# Altium project PCB4Layer.PrjPcb
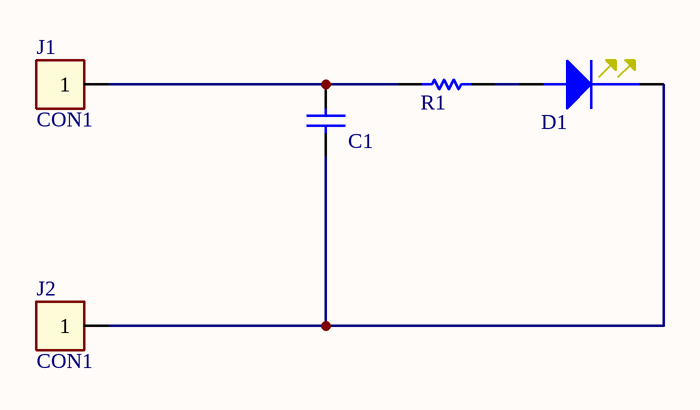
[diagram p0: PCB4Layer.SchDoc]
sch_revision: 0.1; sch_partno: sch_partno; proj_title: PCB4Layer; pcb_revision: 0.1; pcb_partno: pcb_parno
1 sheet, 5 parts. Net scope: global (net labels, ports and power ports of the same name join across sheets).
Board file: PCB4Layer.PcbDoc

## Sheet PCB4Layer.SchDoc
size Letter

### Parts
C1  1u  [SM/IPC/C_1206]  (value not drawn)
D1  YELLOW LED  [RH/LED_T1]  (value not drawn)
J1  CON1  [BATTERYCONTACT]  (no BOM)
J2  CON1  [BATTERYCONTACT]  (no BOM)
R1  1k  [SM/IPC/R_1206]  (value not drawn)

### Nets
NetC1_1: C1.1 D1.C J2.1
NetC1_2: C1.2 J1.1 R1.1
NetD1_A: D1.A R1.2

### Library data of the parts
C1 = CAP_1u_10%_100V_1206_X7R: CAP CER 1UF 100V X7R 1206; Manufacturer 1: AVX Corporation; Manufacturer Part Number 1: 12061C105KAT2A; Tolerance: 10%; Part Number: CAP_1u_10%_100V_1206_X7R; Component Kind: Standard; Component Type: Standard; PACKAGE: 1206(3216); Pin Count: 2; Material: X7R; Value: 1u; VOLTAGE: 100V; Supplier 1: Digi-Key; Supplier Part Number 1: 478-6226-1-ND
D1 = LED_YEL_T1: Manufacturer 1: Vishay Semiconductor; Manufacturer Part Number 1: TLHY4405; Part Number: LED_YEL_T1; Component Kind: Standard; Component Type: Standard; PACKAGE: T-1; Pin Count: 2; Supplier 1: Digi-Key; Supplier Part Number 1: 751-1144-ND
J1 J2 = CON1: Battery Contact Springs; Part Number: CON1; Component Type: Standard (No BOM); Pin Count: 1
R1 = R_1k_1%_1206: RES SMD 1K OHM 1% 1/4W 1206; Manufacturer 1: Yageo; Manufacturer Part Number 1: RC1206FR-071KP; WATTAGE: 0.25W; Part Number: R_1k_1%_1206; Component Kind: Standard; Component Type: Standard; PACKAGE: 1206(3216); Pin Count: 2; Tolerance: 1%; Value: 1k; Supplier 1: Digi-Key; Supplier Part Number 1: YAG1338CT-ND

## Assembly variants
Base_Variant: all parts fitted